# Altium schematic sheet USB.SchDoc
size A4; SheetNumber: 4; SheetTotal: 11
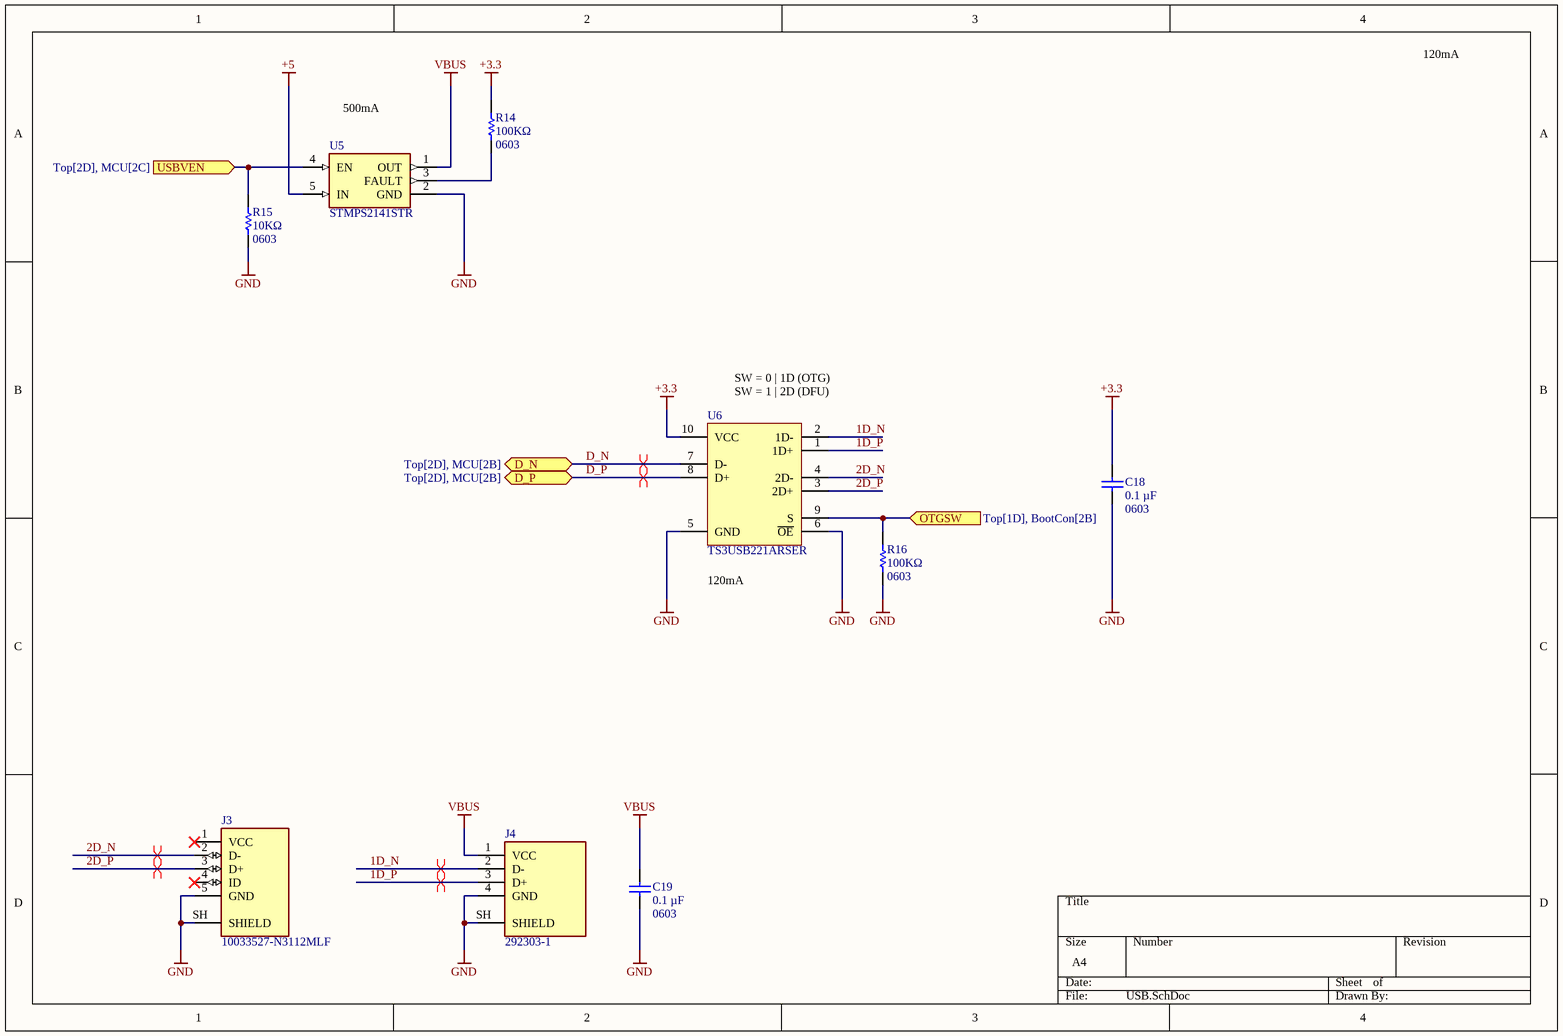
[diagram p0: USB.SchDoc]

## Parts
C18  value 0.1 µF  [0603]  (hidden comment: GRM188R72A104MA35J)
C19  value 0.1 µF  [0603]  (hidden comment: GRM188R72A104MA35J)
J3  10033527-N3112MLF  [10033527-N3112MLF]
J4  292303-1  [PCBComponent_1]
R14  value 100KΩ  [0603]  (hidden comment: RMCF0603FG100K)
R15  value 10KΩ  [0603]  (hidden comment: RMCF0603FG10K0)
R16  value 100KΩ  [0603]  (hidden comment: RMCF0603FG100K)
U5  STMPS2141STR  [SOT-23-5]
U6  TS3USB221ARSER  [10-UFQFN]

## Ports
D_N (bidir, see Top[2D], MCU[2B]), D_P (bidir, see Top[2D], MCU[2B]), OTGSW (in, see Top[1D], BootCon[2B]), USBVEN (in, see Top[2D], MCU[2C])

## Nets
+3.3: C18.2 R14.1 U6.10(VCC)
+5: U5.5(IN)
GND: C18.1 C19.1 J3.5(GND) J3.SH(SHIELD) J4.4(GND) J4.SH(SHIELD) R15.1 R16.2 U5.2(GND) U6.5(GND) U6.6(~{OE})
VBUS: C19.2 J4.1(VCC) U5.1(OUT)
1D_N: J4.2(D-) U6.2(1D-)
1D_P: J4.3(D+) U6.1(1D+)
2D_N: J3.2(D-) U6.4(2D-)
2D_P: J3.3(D+) U6.3(2D+)
D_N: U6.7(D-) ; port D_N
D_P: U6.8(D+) ; port D_P
OTGSW: R16.1 U6.9(S) ; port OTGSW
USBVEN: R15.2 U5.4(EN) ; port USBVEN
NetR14_2: R14.2 U5.3(FAULT)

Not connected (* = marked no-connect by the designer): J3 1(VCC)* 4(ID)*

## Layout directives
differential pair: 1D_N, 1D_P, 2D_N, 2D_P, D_N, D_P

## Notes on the sheet
- 120mA
- (near U5) 500mA
- (near U6) SW = 0 | 1D (OTG)
  SW = 1 | 2D (DFU)
- (near U6) 120mA

## Library data of the parts
C18 C19 = GRM188R72A104MA35J: 0.1 µF ±20% 100V Ceramic Capacitor X7R 0603 (1608 Metric); Case: 0603; Tolerance: ±20%; Temperature Coefficient: X7R; Voltage: 100V
J3 = 10033527-N3112MLF: USB - mini AB USB 2.0 Receptacle Connector 5 Position Surface Mount, Right Angle; pin to pad: SH>SH1+SH2+SH3+SH4; Current Rating: 1A; Voltage: 30V; Specifications: USB 2.0
J4 = 292303-1: USB-A (USB TYPE-A) USB 2.0 Receptacle Connector 4 Position Through Hole, Right Angle; pin to pad: SH>SH1+SH2; Specifications: USB 2.0; Current Rating: 1A
R14 R16 = RMCF0603FG100K: 100 kOhms ±1% 0.1W, 1/10W Chip Resistor 0603 (1608 Metric) Automotive AEC-Q200 Thick Film; Case: 0603; Tolerance: 1%; Power: 0.1W
R15 = RMCF0603FG10K0: 10 kOhms ±1% 0.1W, 1/10W Chip Resistor 0603 (1608 Metric) Automotive AEC-Q200 Thick Film; Case: 0603; Tolerance: 1%; Power: 0.1W
U5 = STMPS2141STR: Power Switch/Driver 1:1 N-Channel 500mA SOT-23-5
U6 = TS3USB221ARSER: USB Switch IC 2 Channel 10-UQFN (2.0x1.5)